# Altium schematic sheet DS1307.SchDoc
size Legal; SheetNumber: 7; SheetTotal: 8
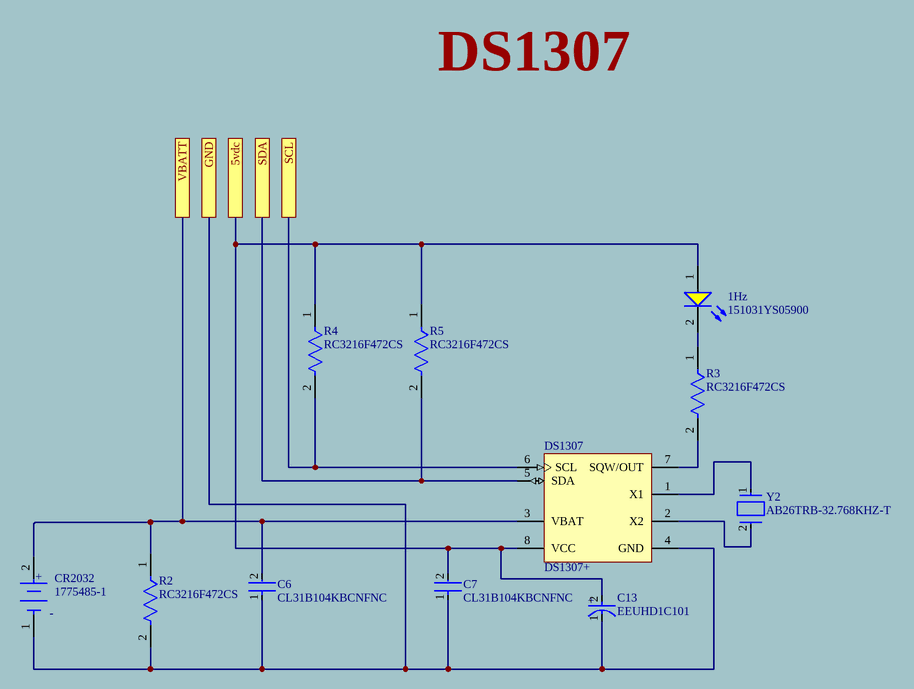
[diagram p0: DS1307.SchDoc]

## Parts
1Hz  151031YS05900  [WL-TMRC_D3.95H5.3]
C6  CL31B104KBCNFNC  [FP-CL31-IPC_C]
C7  CL31B104KBCNFNC  [FP-CL31-IPC_C]
C13  EEUHD1C101  [FP-RAD-TH-D_5_0_5-L_11_1-MFG]
CR2032  1775485-1  [FP-1775485-1-MFG]
DS1307  DS1307+  [P8+2]
R2  RC3216F472CS  [FP-RC3216-MFG]
R3  RC3216F472CS  [FP-RC3216-MFG]
R4  RC3216F472CS  [FP-RC3216-MFG]
R5  RC3216F472CS  [FP-RC3216-MFG]
Y2  AB26TRB-32.768KHZ-T  [FP-AB26TRB-MFG]

## Ports
5vdc, GND, SCL, SDA, VBATT

## Nets
5vdc: 1Hz.1(A) C7.2 C13.2(A) DS1307.8(VCC) R4.1 R5.1 ; port 5vdc
GND: C6.1 C7.1 C13.1(C) CR2032.1(C) DS1307.4(GND) R2.2 ; port GND
SCL: DS1307.6(SCL) R4.2 ; port SCL
SDA: DS1307.5(SDA) R5.2 ; port SDA
VBATT: C6.2 CR2032.2(A) DS1307.3(VBAT) R2.1 ; port VBATT
Net1Hz_2: 1Hz.2(K) R3.1
NetDS1307_1: DS1307.1(X1) Y2.1
NetDS1307_2: DS1307.2(X2) Y2.2
NetDS1307_7: DS1307.7(SQW/OUT) R3.2

## Notes on the sheet
- DS1307
- (in symbol CMP-03355-000025-1) +; -
- (in symbol CMP-05427-000949-1) +

## Library data of the parts
1Hz = CMP-1488-00003-2: NexarPartId: 29717806; Wavelength: 585nm; Forward Voltage: 2.1V; Lens Style: Circular, Diffused, Round; Viewing Angle: 60°; Forward Current: 100mA; Dominant Wavelength: 590nm; Test Current: 20mA; Max Reverse Voltage (DC): 5V; Luminous Intensity: 30mcd; Lens Size: 3mm; Max Operating Temperature: 85°C; Mount: Through Hole; Color: Yellow; Length: 3mm; Packaging: Bulk; Width: 3mm; Height: 5.3mm; Min Operating Temperature: -40°C; RoHS: Compliant; REACH SVHC: Unknown; Case/Package: Radial; Peak Wavelength: 585nm
C6 C7 = CMP-13271-001276-1: Cap Ceramic 100nF 50V X7R ±10% SMD 1206 +125°C Embossed T/R; Dielectric: X7R; Case Code (Metric): 3216; Package Quantity: 1; Thickness: 0.037inch; Depth: 1.6mm; Packaging: Tape and Reel; Capacitance: 100nF; Length: 0.126inch; Tolerance: 10%; Voltage Rating: 50V; Case Code (Imperial): 1206; Radiation Hardening: No; Width: 0.063inch; Case/Package: 1206; Max Operating Temperature: 125°C; Min Operating Temperature: -55°C; Height: 0.85mm; Mount: Surface Mount
C13 = CMP-05427-000949-1: Aluminum Electrolytic Capacitors (Radial Lead Type) AEC-Q200 Qualified 100uF ±20% 16V; Lead/Base Style: Straight; Life (Hours): 1000Hour; Polarity: Polar; Ripple Current: 110mA; Lead Diameter: 0.5mm; Packaging: Bulk; Tolerance: 20%; Package Quantity: 200; Lead Pitch: 2.5mm; RoHS Compliant: Yes; Length: 11mm; Capacitance: 100uF; Max Operating Temperature: 105°C; REACH SVHC: No SVHC; Termination: Radial; Lead Free: Lead Free; Number of Pins: 2; Ripple Current (AC): 110mA; Mount: Through Hole; Diameter: 5mm; Min Operating Temperature: -55°C; Construction: RADIAL; Voltage Rating: 16V; Voltage Rating (DC): 16V; Case/Package: Radial; Height: 11mm; Height - Seated (Max): 0.492inch; Voltage: 16V; Series: HD
CR2032 = CMP-03355-000025-1: BATT HLDR COIN 20MM 1 CEL PC PIN; Material: Nylon; Number of Contacts: 2; Color: Black; Number of Ports: 1; Package Quantity: 80; Packaging: Tray; Orientation: Straight; Radiation Hardening: No; ELV: Compliant; Contact Material: Stainless Steel; Number of Terminals/Pins: 2; RoHS Compliant: Yes; Housing Color: Black; Mount: Through Hole; Number of Positions: 2; Housing Material: Nylon; Termination: Solder
DS1307 = CMP-0254-00152-1: 64 x 8, Serial, I2C Real-Time Clock, 5.0V, 8-Pin PDIP, 0 to 70 degC, Pb-Free; ComponentLink2URL: http://datasheets.maxim-ic.com/en/ds/DS1307.pdf; ComponentLink3URL: http://pdfserv.maxim-ic.com/package_dwgs/21-0043.PDF; ComponentLink1Description: Manufacturer URL; PackageVersion: revE, 2011; ComponentLink1URL: http://www.maxim-ic.com; PackageDescription: 8-Pin Plastic Dual-In-Line, Narrow (0.3in), Pitch 2.54 mm, PDIP(N), Pb-Free; ComponentLink2Description: Datasheet; Code_JEDEC: MS-001-AB; PackageReference: P8+2; DatasheetVersion: 10-Feb-2008; ComponentLink3Description: Package Specification
R2-R5 = CMP-13261-005727-1: Res Thick Film 1206 4.7kΩ 1% 0.25W ±100ppm/°C Molded SMD T/R; Max Power Dissipation: 250mW; Resistance: 4.7kR; Voltage Rating (DC): 200V; Case Code (Metric): 3216; Number of Terminations: 2; Length: 0.126inch; Case/Package: 1206; Contact Plating: Tin; Features: Moisture Resistant; Radiation Hardening: No; Tolerance: 1%; Min Operating Temperature: -55°C; Depth: 1.6mm; Lead Free: Lead Free; Composition: Thick Film; Height: 0.026inch; Width: 0.063inch; Temperature Coefficient: 100ppm/°C; Max Operating Temperature: 155°C; Packaging: Tape and Reel; Case Code (Imperial): 1206; Military Standard: Not
Y2 = CMP-27762-006068-1: CRYSTAL 32.7680KHZ 12.5PF TH; Frequency Stability: -0.034ppm; Frequency Tolerance: 20ppm; Series Resistance: 50kR; Case/Package: Radial; Package Quantity: 500; Packaging: Tape and Reel; Lead Pitch: 2.54mm; Termination: Radial; Mount: Surface Mount; Frequency: 32.768kHz; Min Operating Temperature: -40°C; REACH SVHC: No SVHC; Load Capacitance: 12.5pF; Lead Free: Lead Free; Operating Frequency: 32.768 kHz; Max Operating Temperature: 85°C; Length: 6mm; Height: 0.075inch; Depth: 1.9mm; Tolerance: 20ppm; ESR (Equivalent Series Resistance): 50kR; Number of Pins: 2; Series: AB26TRB